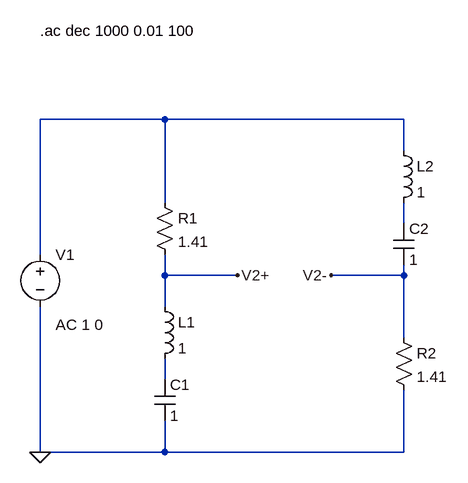
[diagram p0: schematic Circuito_2b.asc]
Circuito_2b.asc, the LTspice schematic file:
Version 4
SHEET 1 880 680
WIRE 144 -80 -48 -80
WIRE 512 -80 144 -80
WIRE 512 -32 512 -80
WIRE 144 48 144 -80
WIRE 512 80 512 48
WIRE -48 128 -48 -80
WIRE 144 160 144 128
WIRE 256 160 144 160
WIRE 512 160 512 144
WIRE 512 160 400 160
WIRE 144 208 144 160
WIRE 512 256 512 160
WIRE 144 320 144 288
WIRE -48 432 -48 208
WIRE 144 432 144 384
WIRE 144 432 -48 432
WIRE 512 432 512 336
WIRE 512 432 144 432
FLAG 400 160 V2-
FLAG 256 160 V2+
FLAG -48 432 0
SYMBOL res 128 32 R0
SYMATTR InstName R1
SYMATTR Value 1.41
SYMBOL res 496 240 R0
SYMATTR InstName R2
SYMATTR Value 1.41
SYMBOL ind 128 192 R0
SYMATTR InstName L1
SYMATTR Value 1
SYMBOL ind 496 -48 R0
SYMATTR InstName L2
SYMATTR Value 1
SYMBOL cap 128 320 R0
SYMATTR InstName C1
SYMATTR Value 1
SYMBOL cap 496 80 R0
SYMATTR InstName C2
SYMATTR Value 1
SYMBOL voltage -48 112 R0
WINDOW 123 24 124 Left 2
WINDOW 39 0 0 Left 0
SYMATTR InstName V1
SYMATTR Value ""
SYMATTR Value2 AC 1 0
TEXT -48 -216 Left 2 !.ac dec 1000 0.01 100

The netlist it stands for:
* Circuito_2b.asc
R1 N001 V2+ 1.41
R2 V2- 0 1.41
L1 V2+ N003 1
L2 N001 N002 1
C1 N003 0 1
C2 N002 V2- 1
V1 N001 0 AC 1 0
.ac dec 1000 0.01 100
.backanno
.end

* Results of the author's LTspice run, read from the files saved beside the schematic
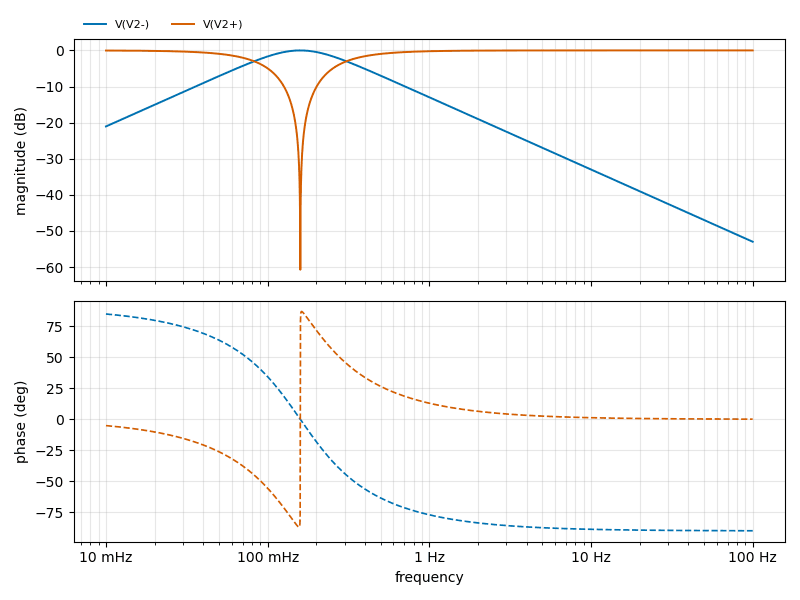
[diagram p1: AC Analysis of Circuito_2b.asc, plotted from the saved traces]
* AC Analysis, 1 run:
*   V(V2-): -21.05 dB at 10 mHz, -52.98 dB at 100 Hz, peak -0.01 dB at 159.2 mHz, 3 dB below the peak at 82.49 mHz and 307.1 mHz
*   V(V2+): -0.03 dB at 10 mHz, -0.00 dB at 100 Hz, peak -0.00 dB at 100 Hz, 3 dB below the peak at 307.1 mHz